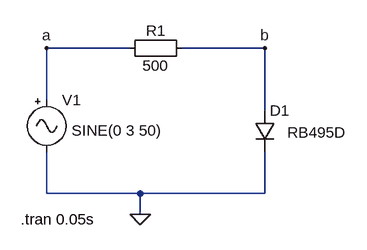
[diagram p0: schematic LD-P.asc]
LD-P.asc, the LTspice schematic file:
Version 4
SHEET 1 880 680
WIRE 32 144 -96 144
WIRE 240 144 112 144
WIRE -96 224 -96 144
WIRE 240 240 240 144
WIRE -96 368 -96 304
WIRE 48 368 -96 368
WIRE 240 368 240 304
WIRE 240 368 48 368
WIRE 48 400 48 368
FLAG -96 144 a
FLAG 240 144 b
FLAG 48 400 0
SYMBOL diode 224 240 R0
WINDOW 3 51 34 Left 2
SYMATTR InstName D1
SYMATTR Value RB495D
SYMBOL Misc\\signal -96 208 R0
WINDOW 123 0 0 Left 2
WINDOW 39 0 0 Left 2
WINDOW 3 38 63 Left 2
SYMATTR Value SINE(0 3 50)
SYMATTR InstName V1
SYMBOL Misc\\EuropeanResistor 128 128 R90
WINDOW 0 5 56 VBottom 2
WINDOW 3 27 56 VTop 2
SYMATTR InstName R1
SYMATTR Value 500
TEXT -136 408 Left 2 !.tran 0.05s

The netlist it stands for:
* LD-P.asc
D1 b 0 RB495D
V1 a 0 SINE(0 3 50)
R1 b a 500
.model D D
.lib standard.dio
.tran 0.05s
.backanno
.end